# EAGLE schematic ArduinoMiniShield_Blank (EAGLE 7.4.0)
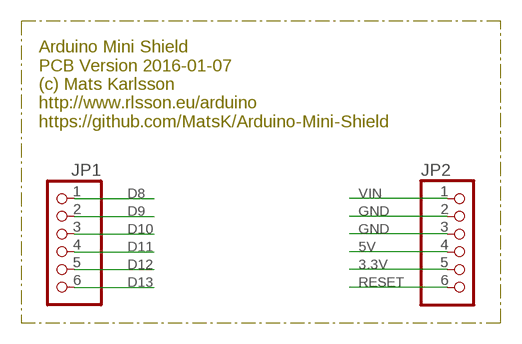
[diagram p0: schematic, sheet 1]

## Parts
JP1  PINHD-1X6B  [1X06-BIG]
JP2  PINHD-1X6B  [1X06-BIG]

## Nets
3.3V [RFBoard]: JP2.5
5V [RFBoard]: JP2.4
D8 [RFBoard]: JP1.1
D9 [RFBoard]: JP1.2
D10 [RFBoard]: JP1.3
D11 [RFBoard]: JP1.4
D12 [RFBoard]: JP1.5
D13 [RFBoard]: JP1.6
GND [RFBoard]: JP2.2 JP2.3
RESET [RFBoard]: JP2.6
VIN [RFBoard]: JP2.1

## Notes on the sheet
- Arduino Mini Shield
  PCB Version 2016-01-07
  (c) Mats Karlsson
  http://www.rlsson.eu/arduino
  https://github.com/MatsK/Arduino-Mini-Shield

## Library data of the parts
JP1 JP2 = adafruit:PINHD-1X6: PIN HEADER

## Net classes
1 RFBoard: width 0.406 mm